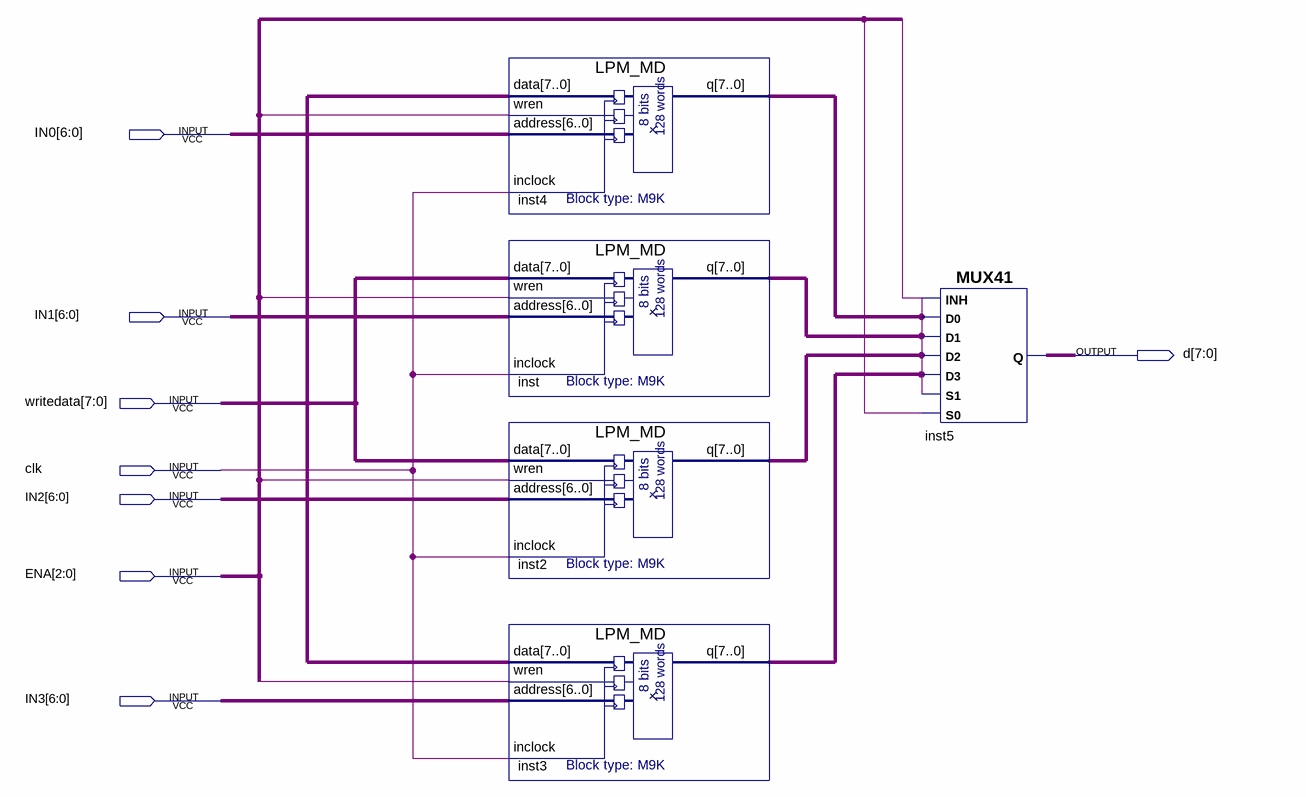
[diagram p0: schematic sheet]
// Quartus schematic triBUS4_1.bdf as structural Verilog: 5 symbols, 8 pins
module triBUS4_1 (
  input  [6:0] IN0,
  input  [6:0] IN1,
  input  [7:0] writedata,
  input  clk,
  input  [6:0] IN2,
  input  [2:0] ENA,
  input  [6:0] IN3,
  output [7:0] d
);

  wire undriven, undriven_2, undriven_3, undriven_4, undriven_5, undriven_6;
  wire [7:0] inst2_q, inst3_q, inst4_q, inst_q;

  LPM_MD inst4 (.data(writedata), .wren(undriven), .address(IN0), .inclock(clk), .q(inst4_q));
  LPM_MD inst (.data(writedata), .wren(undriven_2), .address(IN1), .inclock(clk), .q(inst_q));
  LPM_MD inst2 (.data(writedata), .wren(undriven_3), .address(IN2), .inclock(clk), .q(inst2_q));
  LPM_MD inst3 (.data(writedata), .wren(undriven_4), .address(IN3), .inclock(clk), .q(inst3_q));
  MUX41 inst5 (
    .S0(undriven_5), .D2(inst2_q), .S1(undriven_6), .D3(inst3_q), .D0(inst4_q), .INH(undriven_6),
    .D1(inst_q), .Q(d));
endmodule
